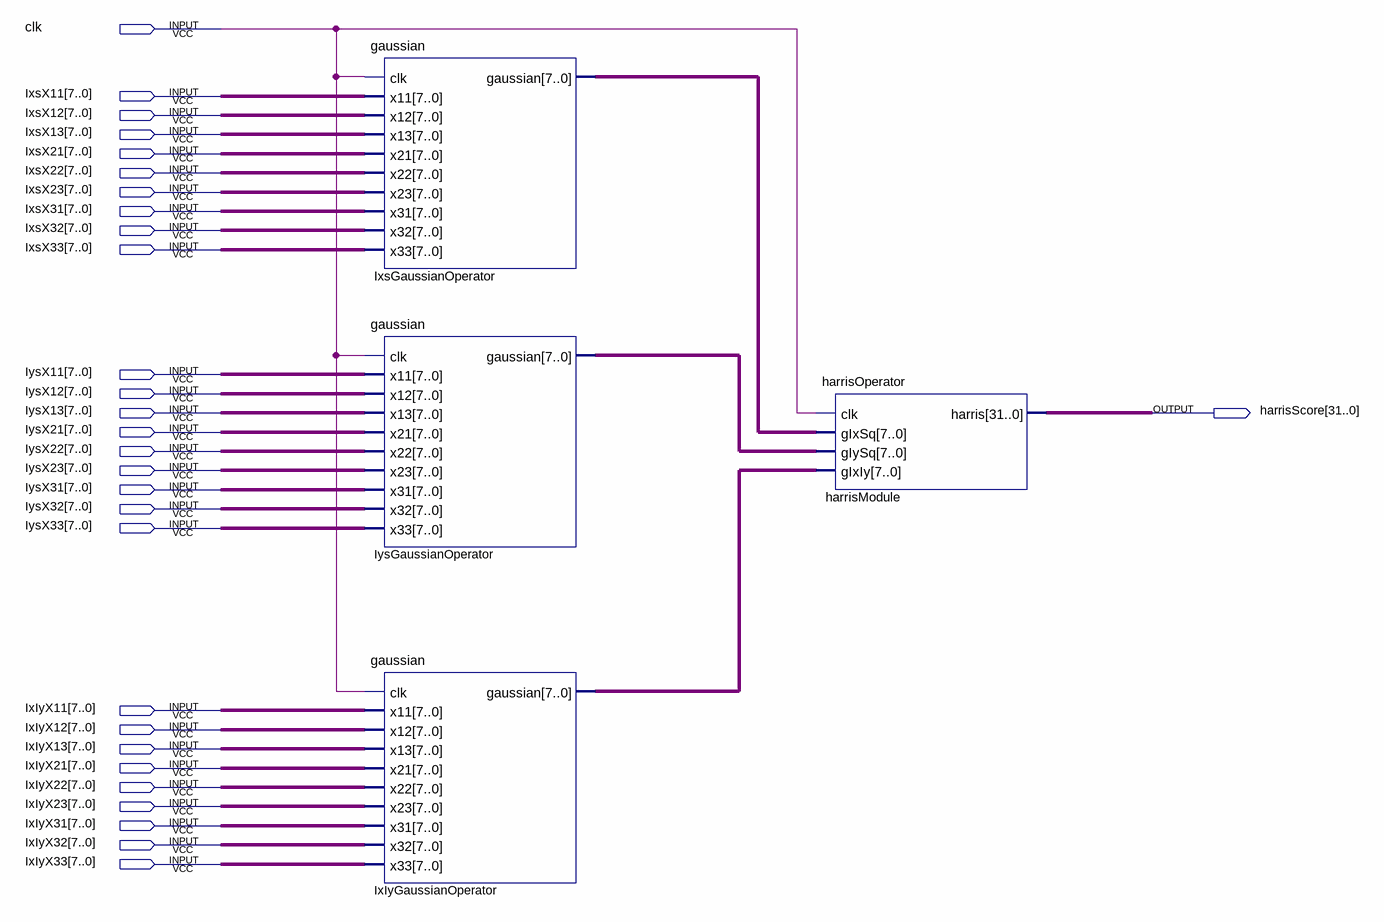
[diagram p0: schematic sheet]
// Quartus schematic operationTwo.bdf as structural Verilog: 4 symbols, 29 pins
module operationTwo (
  input  clk,
  input  [7:0] IxsX11,
  input  [7:0] IxsX12,
  input  [7:0] IxsX13,
  input  [7:0] IxsX21,
  input  [7:0] IxsX22,
  input  [7:0] IxsX23,
  input  [7:0] IxsX31,
  input  [7:0] IxsX32,
  input  [7:0] IxsX33,
  input  [7:0] IysX11,
  input  [7:0] IysX12,
  input  [7:0] IysX13,
  input  [7:0] IysX21,
  input  [7:0] IysX22,
  input  [7:0] IysX23,
  input  [7:0] IysX31,
  input  [7:0] IysX32,
  input  [7:0] IysX33,
  input  [7:0] IxIyX11,
  input  [7:0] IxIyX12,
  input  [7:0] IxIyX13,
  input  [7:0] IxIyX21,
  input  [7:0] IxIyX22,
  input  [7:0] IxIyX23,
  input  [7:0] IxIyX31,
  input  [7:0] IxIyX32,
  input  [7:0] IxIyX33,
  output [31:0] harrisScore
);

  wire [7:0] IxIyGaussianOperator_gaussian, IxsGaussianOperator_gaussian, IysGaussianOperator_gaussian;

  gaussian IxsGaussianOperator (
    .clk(clk), .x11(IxsX11), .x12(IxsX12), .x13(IxsX13), .x21(IxsX21), .x22(IxsX22), .x23(IxsX23),
    .x31(IxsX31), .x32(IxsX32), .x33(IxsX33), .gaussian(IxsGaussianOperator_gaussian));
  gaussian IysGaussianOperator (
    .clk(clk), .x11(IysX11), .x12(IysX12), .x13(IysX13), .x21(IysX21), .x22(IysX22), .x23(IysX23),
    .x31(IysX31), .x32(IysX32), .x33(IysX33), .gaussian(IysGaussianOperator_gaussian));
  gaussian IxIyGaussianOperator (
    .clk(clk), .x11(IxIyX11), .x12(IxIyX12), .x13(IxIyX13), .x21(IxIyX21), .x22(IxIyX22), .x23(IxIyX23),
    .x31(IxIyX31), .x32(IxIyX32), .x33(IxIyX33), .gaussian(IxIyGaussianOperator_gaussian));
  harrisOperator harrisModule (
    .clk(clk), .gIxSq(IxsGaussianOperator_gaussian), .gIySq(IysGaussianOperator_gaussian),
    .gIxIy(IxIyGaussianOperator_gaussian), .harris(harrisScore));
endmodule
